# EasyEDA Pro project EasyedaPrj_POCKET_DICE_2026-03-14.epro, schematic Schematic1
Board Name: Board1; Create Date: 2026-01-21; Page Name: P1; Project Name: ALL PCBs; Schematic Name: Schematic1; Update Date: 2026-01-23; Company: EasyEDA.com; Page Size: A4; Version: V1.0
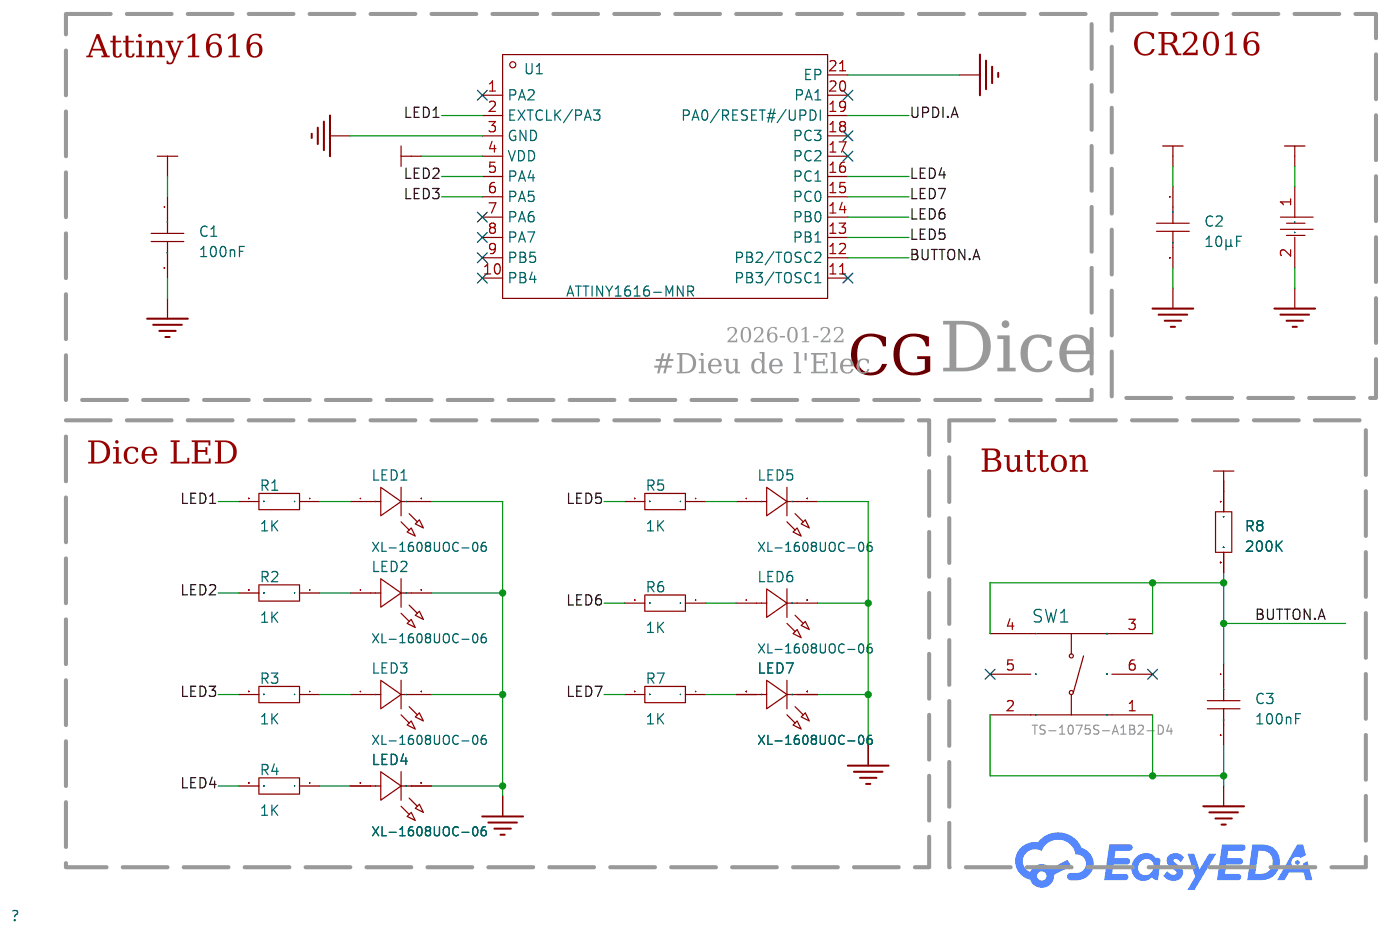
[diagram p0: schematic sheet]

## Parts
C1  100nF  [C0603]
C2  10µF  [C0805]
C3  100nF  [C0603]
LED1  XL-1608UOC-06  [Dice  0603 LED BLANK]
LED2  XL-1608UOC-06  [Dice  0603 LED BLANK]
LED3  XL-1608UOC-06  [Dice  0603 LED BLANK]
LED4  XL-1608UOC-06  [Dice  0603 LED BLANK]
LED5  XL-1608UOC-06  [Dice  0603 LED BLANK]
LED6  XL-1608UOC-06  [Dice  0603 LED BLANK]
LED7  XL-1608UOC-06  [Dice  0603 LED BLANK]
R1  1K  [R0402]
R2  1K  [R0402]
R3  1K  [R0402]
R4  1K  [R0402]
R5  1K  [R0402]
R6  1K  [R0402]
R7  1K  [R0402]
R8  200K  [R0402]
SW1  TS-1075S-A1B2-D4  [SW-SMD_4P-L3.1-W3.1-P2.20-LS4.0]
U1  ATTINY1616-MNR  [QFN-20_L3.0-W3.0-P0.40-BL-EP1.7]
U7  MY-2016-02  [BAT-SMD_MY-2032-08]

## Library data of the parts
C1 C3 = CAP_0603: Supplier Footprint: 0603
C2 = CAP_0805: Supplier Footprint: 0805
LED1-LED7 = XL-1608UOC-06: Illumination Color:Orange Voltage - Forward(Vf):2.3V Voltage - Forward(Vf):2.3V Power(Watts):50mW Forward Current:20mA Wavelength - Dominant:600nm~610nm Wavelength - Dominant:600nm~610nm Peak Wavelength:605nm Lens Color:Colorless Transparent Lens Color Te; Supplier Part: C965800; Manufacturer: XINGLIGHT(成兴光); Supplier Footprint: 0603; JLCPCB Part Class: Extended Part; Datasheet: https://item.szlcsc.com/datasheet/XL-1608UOC-06/1051409.html; Supplier: LCSC; Illumination Color: Orange; Voltage - Forward(Vf): 2.3V; Power(Watts): 50mW; Forward Current: 20mA; Wavelength - Dominant: 600nm~610nm; Peak Wavelength: 605nm; Lens Color: Colorless Transparent Lens; Luminous Intensity: 315mcd; Viewing Angle: 120°; Mounting Sytle: Positive Stick; Operating Temperature: -20℃~+85℃
R1-R8 = Res_0402: Supplier Footprint: 0402
SW1 = TS-1075S-A1B2-D4: Circuit:SPST Actuator Style:Round Button Operating Force:1.8N Mounting Type:- Length:3.1mm Width:3.1mm Switch Height:1.5mm With Lamp:- Life:-; LCSC Part Name: 轻触开关3.0*3.0*1.5mm黑柄正按四脚贴片180gf; Supplier Part: C492872; Manufacturer: Yuandi(元迪); JLCPCB Part Class: Extended Part; Datasheet: https://item.szlcsc.com/datasheet/TS-1075S-A1B2-D4/503552.html; Supplier: LCSC; Circuit: SPST; Actuator Style: Round Button; Operating Force: 1.8N; Length: 3.1mm; Width: 3.1mm; Switch Height: 1.5mm
U1 = ATTINY1616-MNR: CPU Core:AVR CPU Maximum Speed:20MHz Program Storage Size:16KB Program Memory Type:FLASH GPIO Ports Number:18 ADC (Bit):10bit DAC (Bit):8bit Low Voltage Detection Threshold:1.8V~5.5V Low Voltage Detection Threshold:1.8V~5.5V Application Area:-; Supplier Part: C507118; Manufacturer: MICROCHIP(美国微芯); Supplier Footprint: QFN-20-EP(3x3); JLCPCB Part Class: Extended Part; Datasheet: https://atta.szlcsc.com/upload/public/pdf/source/20200402/C507118_C9B3D13493A25E1DA778A35EE1D23665.pdf; Supplier: LCSC; CPU Core: AVR; CPU Maximum Speed: 20MHz; Program Storage Size: 16KB; Program Memory Type: FLASH; GPIO Ports Number: 18; ADC (Bit): 10bit; DAC (Bit): 8bit; Low Voltage Detection Threshold: 1.8V~5.5V
U7 = MY-2016-02: Connector Type:Battery clip Battery Type:CR2016 Contact Material:Phosphor Bronze Contact Plating:Nickel Operating Temperature Range:-25℃~+85℃ Operating Temperature Range:-25℃~+85℃; LCSC Part Name: 电池扣 适用电池:CR2016; Supplier Part: C2979176; Manufacturer: MYOUNG(美阳); Supplier Footprint: SMD; JLCPCB Part Class: Extended Part; Datasheet: https://atta.szlcsc.com/upload/public/pdf/source/20220302/E5D3505CBEA02A6D68587A503653AA7C.pdf; Supplier: LCSC; Connector Type: Battery clip; Battery Type: CR2016; Contact Material: Phosphor Bronze; Contact Plating: Nickel; Operating Temperature Range: -25℃~+85℃

## Nets
GND.A: C1.2 C2.2 C3.2 LED1.2(A) LED2.2(A) LED3.2(A) LED4.2(A) LED5.2(A) LED6.2(A) LED7.2(A) SW1.1 SW1.2 U1.3(GND) U1.21(EP) U7.2
VDD.A: C1.1 C2.1 R8.1 U1.4(VDD) U7.1
BUTTON.A: C3.1 R8.2 SW1.3 SW1.4 U1.12(PB2/TOSC2)
LED1: R1.2 U1.2(EXTCLK/PA3)
LED2: R2.2 U1.5(PA4)
LED3: R3.2 U1.6(PA5)
LED4: R4.2 U1.16(PC1)
LED5: R5.2 U1.13(PB1)
LED6: R6.2 U1.14(PB0)
LED7: R7.2 U1.15(PC0)
UPDI.A: U1.19(PA0/RESET#/UPDI)
$1N725: LED1.1(K) R1.1
$1N793: LED2.1(K) R2.1
$1N861: LED3.1(K) R3.1
$1N1131: LED6.1(K) R6.1
$1N1133: LED5.1(K) R5.1
Net-(LED4-1): LED4.1(K) R4.1
Net-(LED7-1): LED7.1(K) R7.1

Not connected (* = marked no-connect by the designer): SW1 5* 6*; U1 1(PA2)* 7(PA6)* 8(PA7)* 9(PB5)* 10(PB4)* 11(PB3/TOSC1)* 17(PC2)* 18(PC3)* 20(PA1)*

## Notes on the sheet
- Attiny1616
- CR2016
- 2026-01-22
- #Dieu de l'Elec
- CG
- Dice
- Dice LED
- Button
